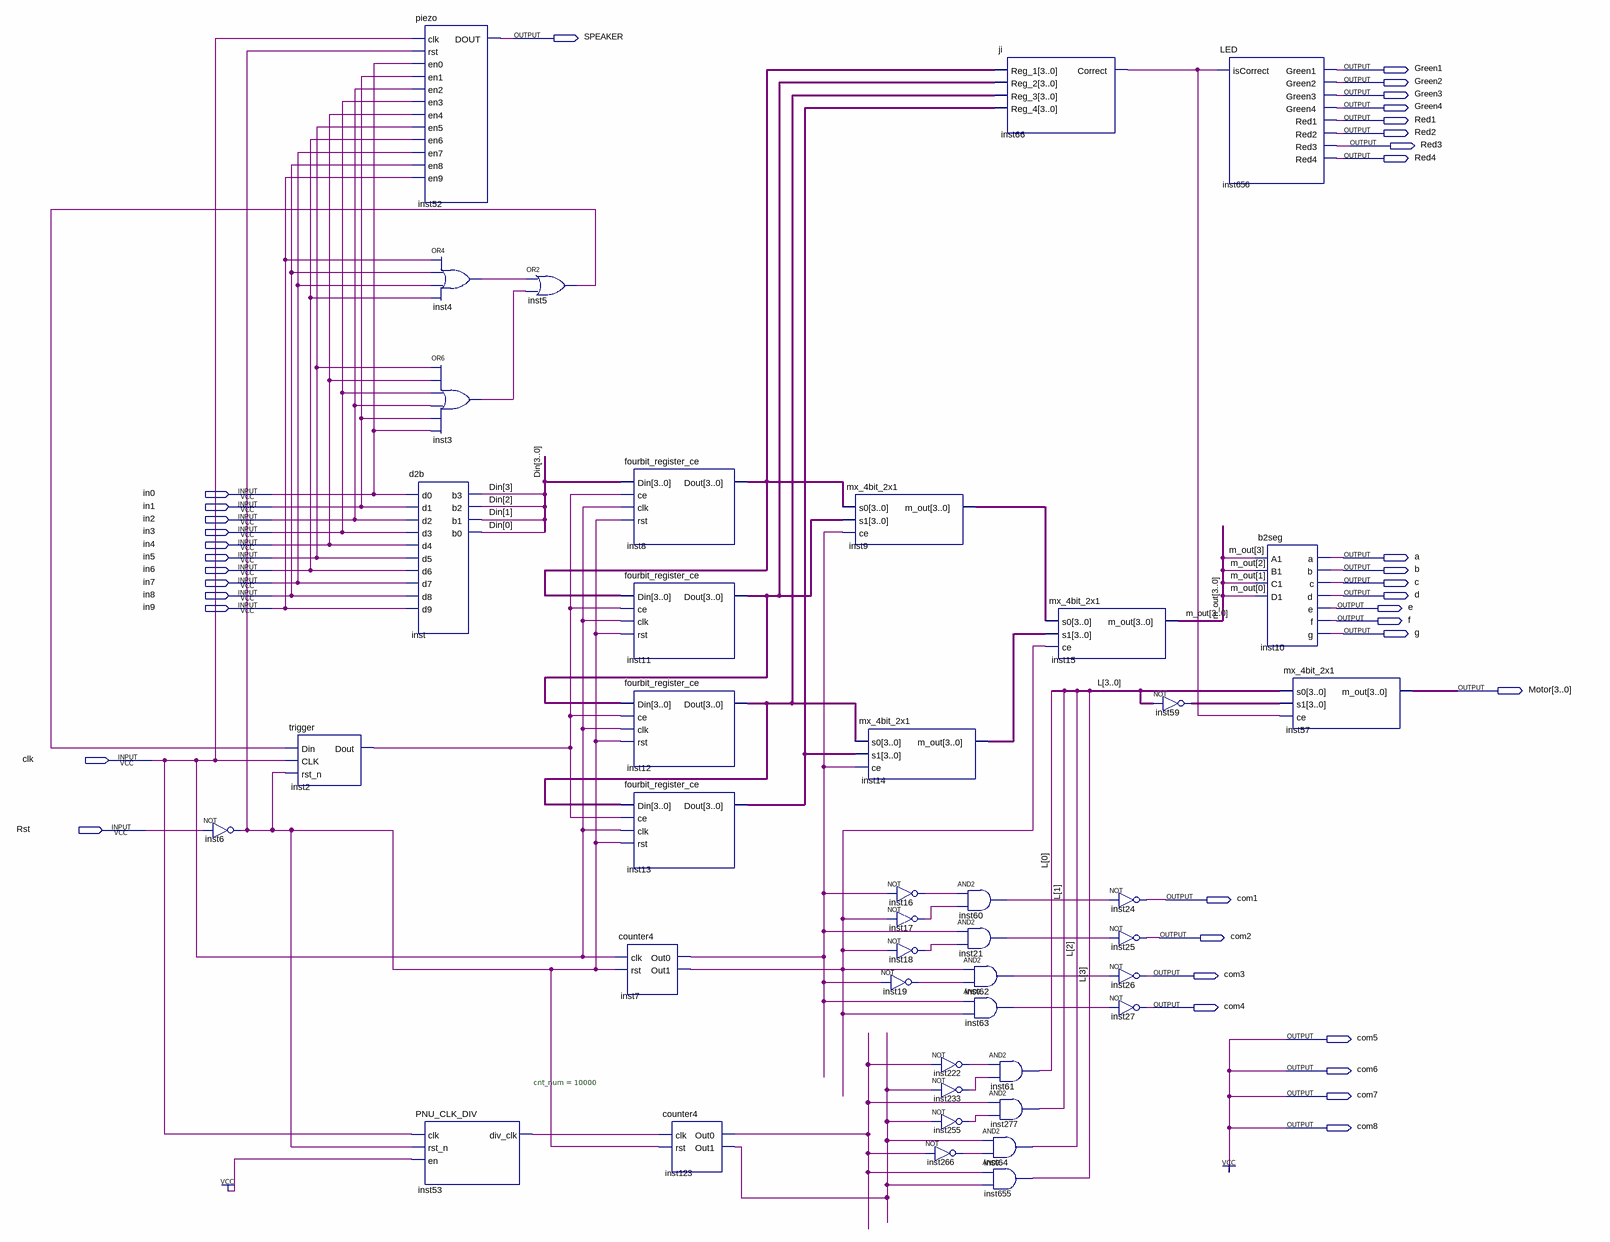
[diagram p0: schematic sheet]
// Quartus schematic tenweek_ex1.bdf as structural Verilog: 42 symbols, 37 pins
module tenweek_ex1 (
  input  in0,
  input  in1,
  input  in2,
  input  in3,
  input  in4,
  input  in5,
  input  in6,
  input  in7,
  input  in8,
  input  in9,
  input  clk,
  input  Rst,
  output SPEAKER,
  output Green1,
  output Green2,
  output Green3,
  output Green4,
  output Red1,
  output Red2,
  output Red3,
  output Red4,
  output a,
  output b,
  output c,
  output d,
  output e,
  output f,
  output g,
  output [3:0] Motor,
  output com1,
  output com2,
  output com3,
  output com4,
  output com5,
  output com6,
  output com7,
  output com8
);

  wire inst2_dout, inst3_out, inst4_out, inst5_out, inst6_out, inst7_out0, inst7_out1, inst16_out,
       inst17_out, inst18_out, inst19_out, inst21_out, inst53_div_clk, inst60_out, inst62_out, inst63_out,
       inst66_correct, inst123_out0, inst123_out1, inst222_out, inst233_out, inst255_out, inst266_out;
  wire [3:0] Din, inst8_dout, inst9_m_out, inst11_dout, inst12_dout, inst13_dout, inst14_m_out, inst59_out,
       L, m_out;

  not inst6 (inst6_out, Rst);
  trigger inst2 (.Din(inst5_out), .CLK(clk), .rst_n(inst6_out), .Dout(inst2_dout));
  piezo inst52 (
    .clk(clk), .rst(inst6_out), .en0(in0), .en1(in1), .en2(in2), .en3(in3), .en4(in4), .en5(in5), .en6(in6),
    .en7(in7), .en8(in8), .en9(in9), .DOUT(SPEAKER));
  d2b inst (
    .d0(in0), .d1(in1), .d2(in2), .d3(in3), .d4(in4), .d5(in5), .d6(in6), .d7(in7), .d8(in8), .d9(in9),
    .b3(Din[3]), .b2(Din[2]), .b1(Din[1]), .b0(Din[0]));
  PNU_CLK_DIV #(.cnt_num(10000)) inst53 (.clk(clk), .rst_n(inst6_out), .en(1'b1), .div_clk(inst53_div_clk));
  or inst4 (inst4_out, in9, in8, in7, in6);
  or inst3 (inst3_out, in5, in4, in3, in2, in1, in0);
  or inst5 (inst5_out, inst4_out, inst3_out);
  fourbit_register_ce inst8 (.Din(Din), .ce(inst2_dout), .clk(clk), .rst(inst6_out), .Dout(inst8_dout));
  fourbit_register_ce inst11 (.Din(inst8_dout), .ce(inst2_dout), .clk(clk), .rst(inst6_out), .Dout(inst11_dout));
  fourbit_register_ce inst12 (.Din(inst11_dout), .ce(inst2_dout), .clk(clk), .rst(inst6_out), .Dout(inst12_dout));
  fourbit_register_ce inst13 (.Din(inst12_dout), .ce(inst2_dout), .clk(clk), .rst(inst6_out), .Dout(inst13_dout));
  counter4 inst7 (.clk(clk), .rst(inst6_out), .Out0(inst7_out0), .Out1(inst7_out1));
  counter4 inst123 (.clk(inst53_div_clk), .rst(inst6_out), .Out0(inst123_out0), .Out1(inst123_out1));
  mx_4bit_2x1 inst9 (.s0(inst8_dout), .s1(inst11_dout), .ce(inst7_out0), .m_out(inst9_m_out));
  mx_4bit_2x1 inst14 (.s0(inst12_dout), .s1(inst13_dout), .ce(inst7_out0), .m_out(inst14_m_out));
  not inst16 (inst16_out, inst7_out0);
  not inst17 (inst17_out, inst7_out1);
  not inst18 (inst18_out, inst7_out1);
  not inst19 (inst19_out, inst7_out0);
  not inst266 (inst266_out, inst123_out0);
  and inst60 (inst60_out, inst16_out, inst17_out);
  and inst21 (inst21_out, inst7_out0, inst18_out);
  and inst62 (inst62_out, inst7_out1, inst19_out);
  and inst63 (inst63_out, inst7_out0, inst7_out1);
  not inst222 (inst222_out, inst123_out0);
  not inst233 (inst233_out, inst123_out1);
  not inst255 (inst255_out, inst123_out1);
  ji inst66 (
    .Reg_1(inst8_dout), .Reg_2(inst11_dout), .Reg_3(inst12_dout), .Reg_4(inst13_dout),
    .Correct(inst66_correct));
  and inst61 (L[0], inst222_out, inst233_out);
  and inst277 (L[1], inst123_out0, inst255_out);
  and inst64 (L[2], inst123_out1, inst266_out);
  and inst655 (L[3], inst123_out0, inst123_out1);
  mx_4bit_2x1 inst15 (.s0(inst9_m_out), .s1(inst14_m_out), .ce(inst7_out1), .m_out(m_out));
  not inst24 (com1, inst60_out);
  not inst25 (com2, inst21_out);
  not inst26 (com3, inst62_out);
  not inst27 (com4, inst63_out);
  assign inst59_out = ~L;  // NOT inst59, 4 bits wide
  LED inst656 (
    .isCorrect(inst66_correct), .Green1(Green1), .Green2(Green2), .Green3(Green3), .Green4(Green4),
    .Red1(Red1), .Red2(Red2), .Red3(Red3), .Red4(Red4));
  b2seg inst10 (
    .A1(m_out[3]), .B1(m_out[2]), .C1(m_out[1]), .D1(m_out[0]), .a(a), .b(b), .c(c), .d(d), .e(e), .f(f),
    .g(g));
  mx_4bit_2x1 inst57 (.s0(L), .s1(inst59_out), .ce(inst66_correct), .m_out(Motor));

  assign com5 = 1'b1;
  assign com6 = 1'b1;
  assign com7 = 1'b1;
  assign com8 = 1'b1;
endmodule
